# Altium schematic sheet Sensors.SchDoc: Наименование
size 209 x 297 mm; ApprovedBy: Утвердил; CheckedBy: Проверил; Author: Разработал; CompanyName: Организация; DrawnBy: Н.Контр; Engineer: Т.Контр; SheetNumber: 5; SheetTotal: 5; PageSetup: Record=PageOptions|CenterHorizontal=True|CenterVertical=True|PrintScale=0.94|XCorrection=1.00|YCorrection=1.00|PrintKind=1|BorderSize=5000000|LeftOffset=0|BottomOffset=0|Orientation=1|PaperLength=1000|PaperWidth=1000|Scale=100|PaperSource=7|PrintQuality=-4|MediaType=1|DitherType=10|PaperKind=A4|PrintScaleMode=1; DecimalNumber: Децимальный номер; HeadOfSector: Нач. сектора; MainDevice: Перв.примен.; Name: Наименование; DocumentName: Sheet1.SCHDOC
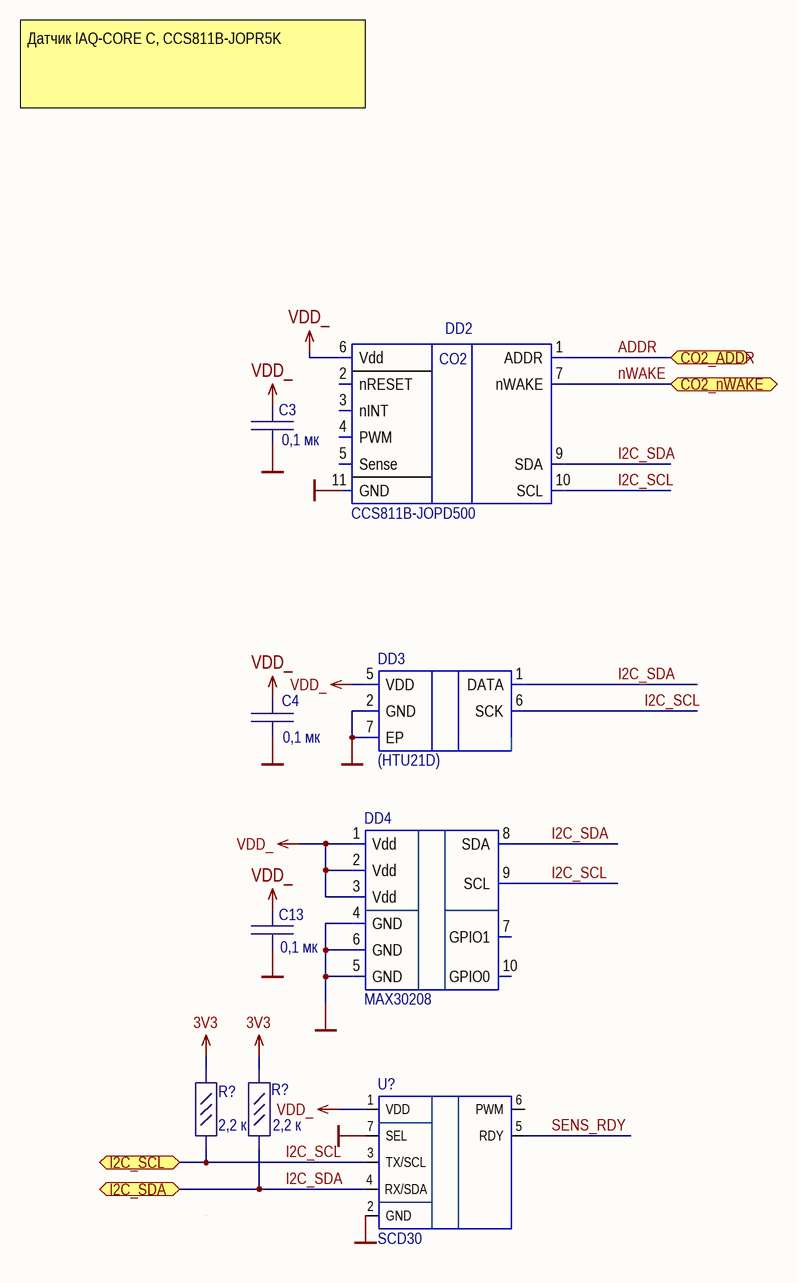
[diagram p0: Sensors.SchDoc]

## Parts
(Parts that share a designator on the sheet are numbered #1, #2 ... from top to bottom, then left to right.)
C3  0,1 мк  [C_0603]
C4  0,1 мк  [C_0603]
C13  0,1 мк  [C_0603]
DD2  CCS811B-JOPD500  [DFN-10 (LGA)]
DD3  (HTU21D)  [DFN-6]
DD4  MAX30208  [MAX30208CLB]
R?#1  2,2 к  [R_0603]
R?#2  2,2 к  [R_0603]
U?  SCD30  [MODULE_SCD30]

## Ports
CO2_ADDR (bidir), CO2_nWAKE (bidir), I2C_SCL (bidir), I2C_SDA (bidir)

## Nets
3V3: R?#1.2 R?#2.2
GND: C3.1 C4.1 C13.1 DD3.2(GND) DD3.7(EP) DD4.4(GND) DD4.5(GND) DD4.6(GND) U?.2(GND) U?.7(SEL)
VDD_: C3.2 C4.2 C13.2 DD2.6(Vdd) DD3.5(VDD) DD4.1(Vdd) DD4.2(Vdd) DD4.3(Vdd) U?.1(VDD)
ADDR: DD2.1(ADDR) ; port CO2_ADDR
I2C_SCL: DD2.10(SCL) DD3.6(SCK) DD4.9(SCL) R?#1.1 U?.3(TX/SCL) ; port I2C_SCL
I2C_SDA: DD2.9(SDA) DD3.1(DATA) DD4.8(SDA) R?#2.1 U?.4(RX/SDA) ; port I2C_SDA
nWAKE: DD2.7(nWAKE) ; port CO2_nWAKE
SENS_RDY: U?.5(RDY)

Not connected (* = marked no-connect by the designer): DD2 2(nRESET) 3(nINT) 4(PWM) 5(Sense) 11(GND); DD4 7(GPIO1) 10(GPIO0); U? 6(PWM)

## Notes on the sheet
- Датчик IAQ-CORE C, CCS811B-JOPR5K
- Labels drawn without touching a wire or pin: GND
- Подп. и дата
- Инв.№ дубл.
- Взам.инв.№
- Подп.и дата
- Инв.№ подл.
- Изм.
- Лист
- № докум.
- Подп.
- Дата
- Формат  A4
- (in symbol CCS811B-JOPD500) CO2

## Library data of the parts
C3 C4 C13 = GRM188R72A104MA35D: CAP CER 0.1UF 100V X7R 0603; Manufacturer: Murata Electronics; Value: 0.1µF; Part Number: GRM188R72A104MA35D; ComponentLink1URL: https://search.murata.co.jp/Ceramy/image/img/A01X/G101/ENG/GRM188R72A104MA35-01.pdf; ComponentLink1Description: Datasheet; Component Type: Capasitor
DD2 = CCS811B-JOPD500: Ultra-Low Power Digital Gas Sensor for / Monitoring Indoor Air Quality
DD3 = HPP845E031R5: Digital Relative Humidity sensor with / Temperature output
DD4 = MAX30208: ±0.1°C Accurate, I2C Digital Temperature Sensor
R?#1 R?#2 = CR0603-FX-2201ELF: RES SMD 2.2K OHM 1% 1/10W 0603; Manufacturer: Bourns Inc.; Part Number: CR0603-FX-2201ELF; Value: 2,2 к; ComponentLink1URL: https://www.bourns.com/pdfs/chpreztr.pdf; ComponentLink1Description: Datasheet; Component Type: Resistor
U? = SCD30: Carbon Dioxide _CO2_ Sensor I²C, Modbus, PWM; MF: Sensirion AG; Package: None; MP: SCD30; Value: *; Availability: Unavailable; SnapEDA_Link: https://www.snapeda.com/parts/SCD30/Sensirion%20AG/view-part/2779194/?ref=snap; Price: None